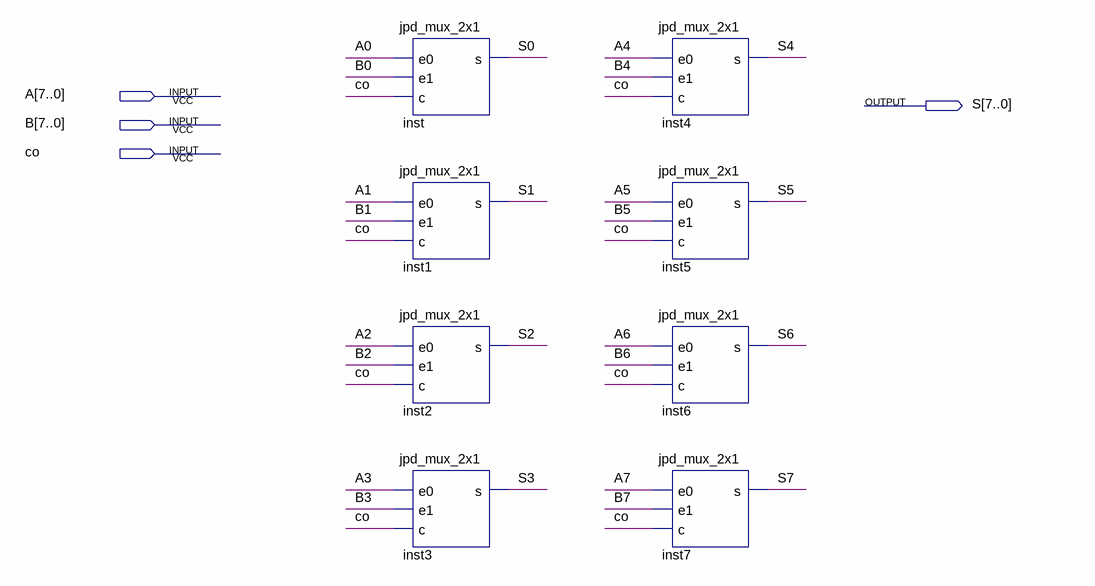
[diagram p0: schematic sheet]
// Quartus schematic jpd_mux_2x1_8bit.bdf as structural Verilog: 8 symbols, 4 pins
module jpd_mux_2x1_8bit (
  input  [7:0] A,
  input  [7:0] B,
  input  co,
  output [7:0] S
);

  jpd_mux_2x1 inst (.e0(A[0]), .e1(B[0]), .c(co), .s(S[0]));
  jpd_mux_2x1 inst1 (.e0(A[1]), .e1(B[1]), .c(co), .s(S[1]));
  jpd_mux_2x1 inst2 (.e0(A[2]), .e1(B[2]), .c(co), .s(S[2]));
  jpd_mux_2x1 inst3 (.e0(A[3]), .e1(B[3]), .c(co), .s(S[3]));
  jpd_mux_2x1 inst4 (.e0(A[4]), .e1(B[4]), .c(co), .s(S[4]));
  jpd_mux_2x1 inst5 (.e0(A[5]), .e1(B[5]), .c(co), .s(S[5]));
  jpd_mux_2x1 inst6 (.e0(A[6]), .e1(B[6]), .c(co), .s(S[6]));
  jpd_mux_2x1 inst7 (.e0(A[7]), .e1(B[7]), .c(co), .s(S[7]));
endmodule
